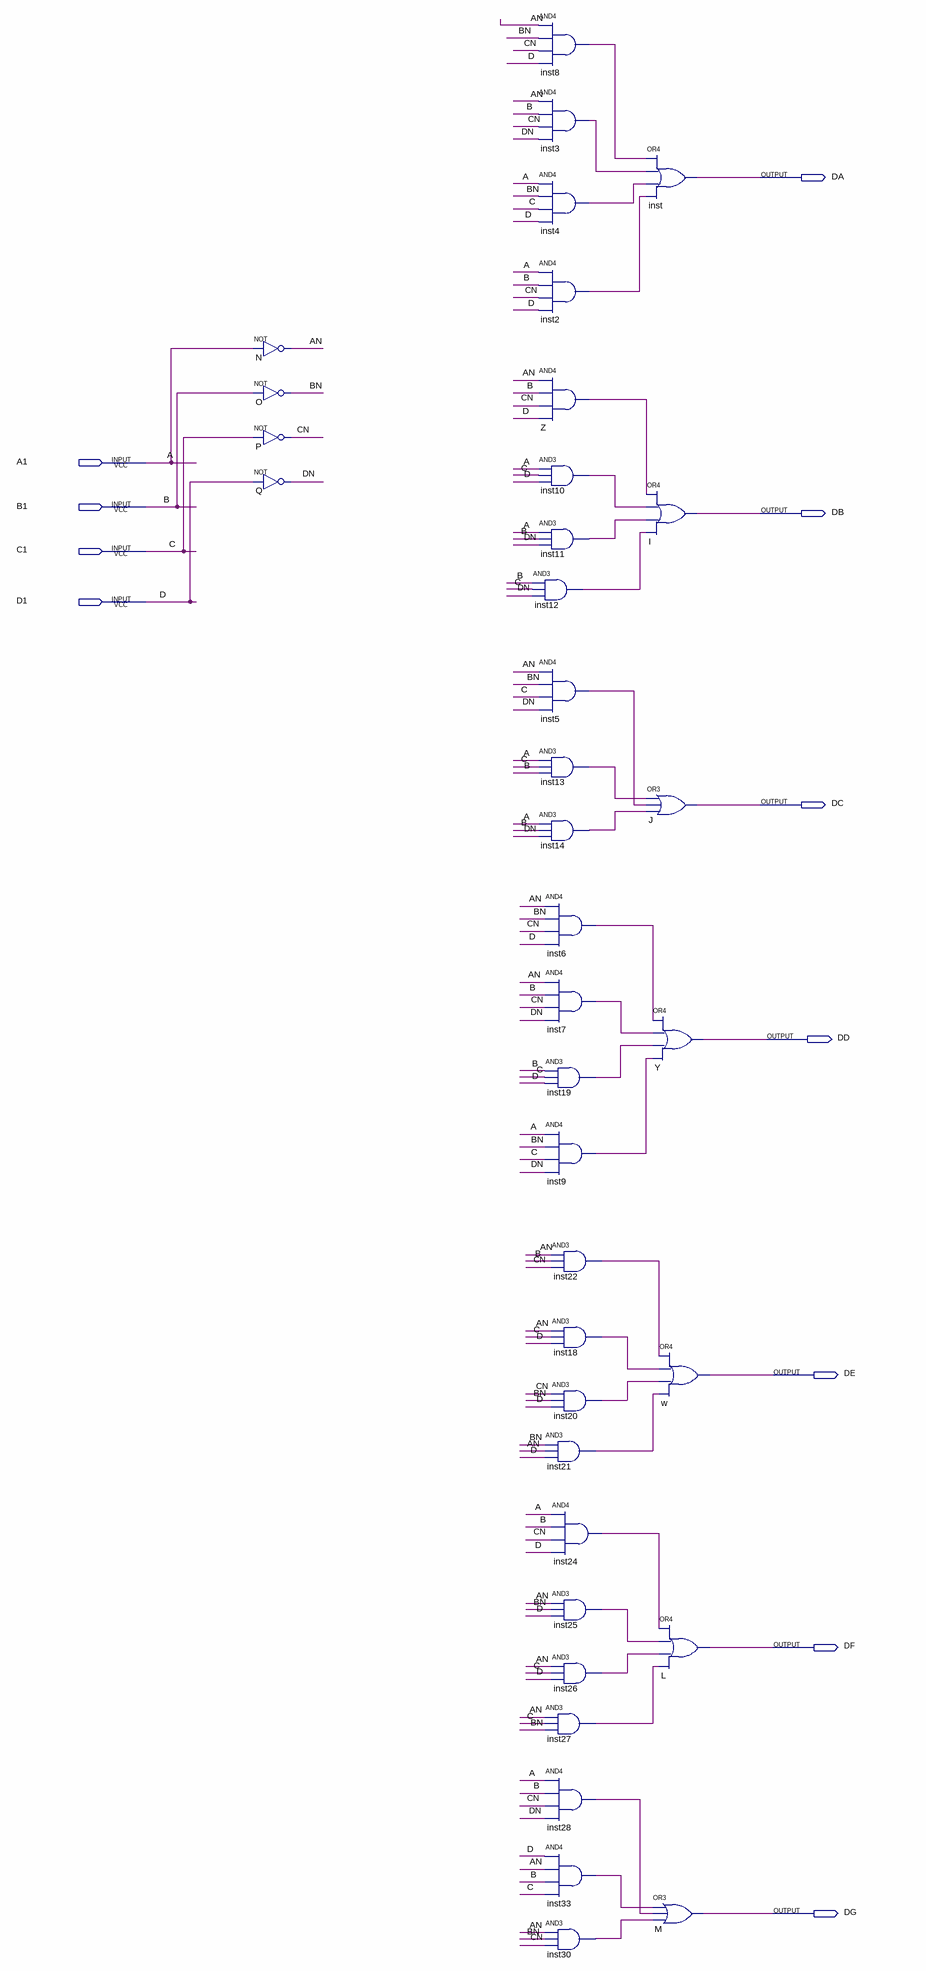
[diagram p0: schematic sheet]
// Quartus schematic display.bdf as structural Verilog: 37 symbols, 11 pins
module display (
  input  A1,
  input  B1,
  input  C1,
  input  D1,
  output DA,
  output DB,
  output DC,
  output DD,
  output DE,
  output DF,
  output DG
);

  wire AN, BN, CN, DN, inst2_out, inst3_out, inst4_out, inst5_out, inst6_out, inst7_out, inst8_out,
       inst9_out, inst10_out, inst11_out, inst12_out, inst13_out, inst14_out, inst18_out, inst19_out,
       inst20_out, inst21_out, inst22_out, inst24_out, inst25_out, inst26_out, inst27_out, inst28_out,
       inst30_out, inst33_out, Z_out;

  not N (AN, A1);
  not O (BN, B1);
  not P (CN, C1);
  not Q (DN, D1);
  and inst8 (inst8_out, AN, BN, CN, D1);
  and inst3 (inst3_out, AN, B1, CN, DN);
  and inst4 (inst4_out, A1, BN, C1, D1);
  and inst2 (inst2_out, A1, B1, CN, D1);
  and Z (Z_out, AN, B1, CN, D1);
  and inst10 (inst10_out, A1, C1, D1);
  and inst11 (inst11_out, A1, B1, DN);
  and inst12 (inst12_out, B1, C1, DN);
  and inst5 (inst5_out, AN, BN, C1, DN);
  and inst13 (inst13_out, A1, C1, B1);
  and inst14 (inst14_out, A1, B1, DN);
  and inst6 (inst6_out, AN, BN, CN, D1);
  and inst7 (inst7_out, AN, B1, CN, DN);
  and inst19 (inst19_out, B1, C1, D1);
  and inst9 (inst9_out, A1, BN, C1, DN);
  and inst22 (inst22_out, AN, B1, CN);
  and inst18 (inst18_out, AN, C1, D1);
  and inst20 (inst20_out, CN, BN, D1);
  and inst21 (inst21_out, BN, AN, D1);
  and inst24 (inst24_out, A1, B1, CN, D1);
  and inst25 (inst25_out, AN, BN, D1);
  and inst26 (inst26_out, AN, C1, D1);
  and inst27 (inst27_out, AN, C1, BN);
  and inst28 (inst28_out, A1, B1, CN, DN);
  and inst33 (inst33_out, D1, AN, B1, C1);
  and inst30 (inst30_out, AN, BN, CN);
  or inst (DA, inst8_out, inst3_out, inst4_out, inst2_out);
  or I (DB, Z_out, inst10_out, inst11_out, inst12_out);
  or J (DC, inst13_out, inst5_out, inst14_out);
  or Y (DD, inst6_out, inst7_out, inst19_out, inst9_out);
  or w (DE, inst22_out, inst18_out, inst20_out, inst21_out);
  or L (DF, inst24_out, inst25_out, inst26_out, inst27_out);
  or M (DG, inst33_out, inst28_out, inst30_out);

  // Other names for the same wires on the sheet: A = A1; B = B1; C = C1; D = D1
endmodule
